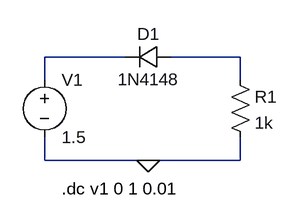
[diagram p0: schematic 1-iv.asc]
1-iv.asc, the LTspice schematic file:
Version 4.1
SHEET 1 880 680
WIRE 176 96 64 96
WIRE 336 96 240 96
WIRE 64 128 64 96
WIRE 336 128 336 96
WIRE 64 240 64 208
WIRE 208 240 64 240
WIRE 336 240 336 208
WIRE 336 240 208 240
FLAG 208 240 0
SYMBOL voltage 64 112 R0
SYMATTR InstName V1
SYMATTR Value 1.5
SYMBOL res 320 112 R0
SYMATTR InstName R1
SYMATTR Value 1k
SYMBOL diode 240 112 M270
WINDOW 0 32 32 VTop 2
WINDOW 3 0 32 VBottom 2
SYMATTR InstName D1
SYMATTR Value 1N4148
TEXT 88 280 Left 2 !.dc v1 0 1 0.01

The netlist it stands for:
* 1-iv.asc
V1 N001 0 1.5
R1 N002 0 1k
D1 N002 N001 1N4148
.model D D
.lib standard.dio
.dc v1 0 1 0.01
.backanno
.end